# Altium schematic sheet Sheet7.SchDoc
size A3
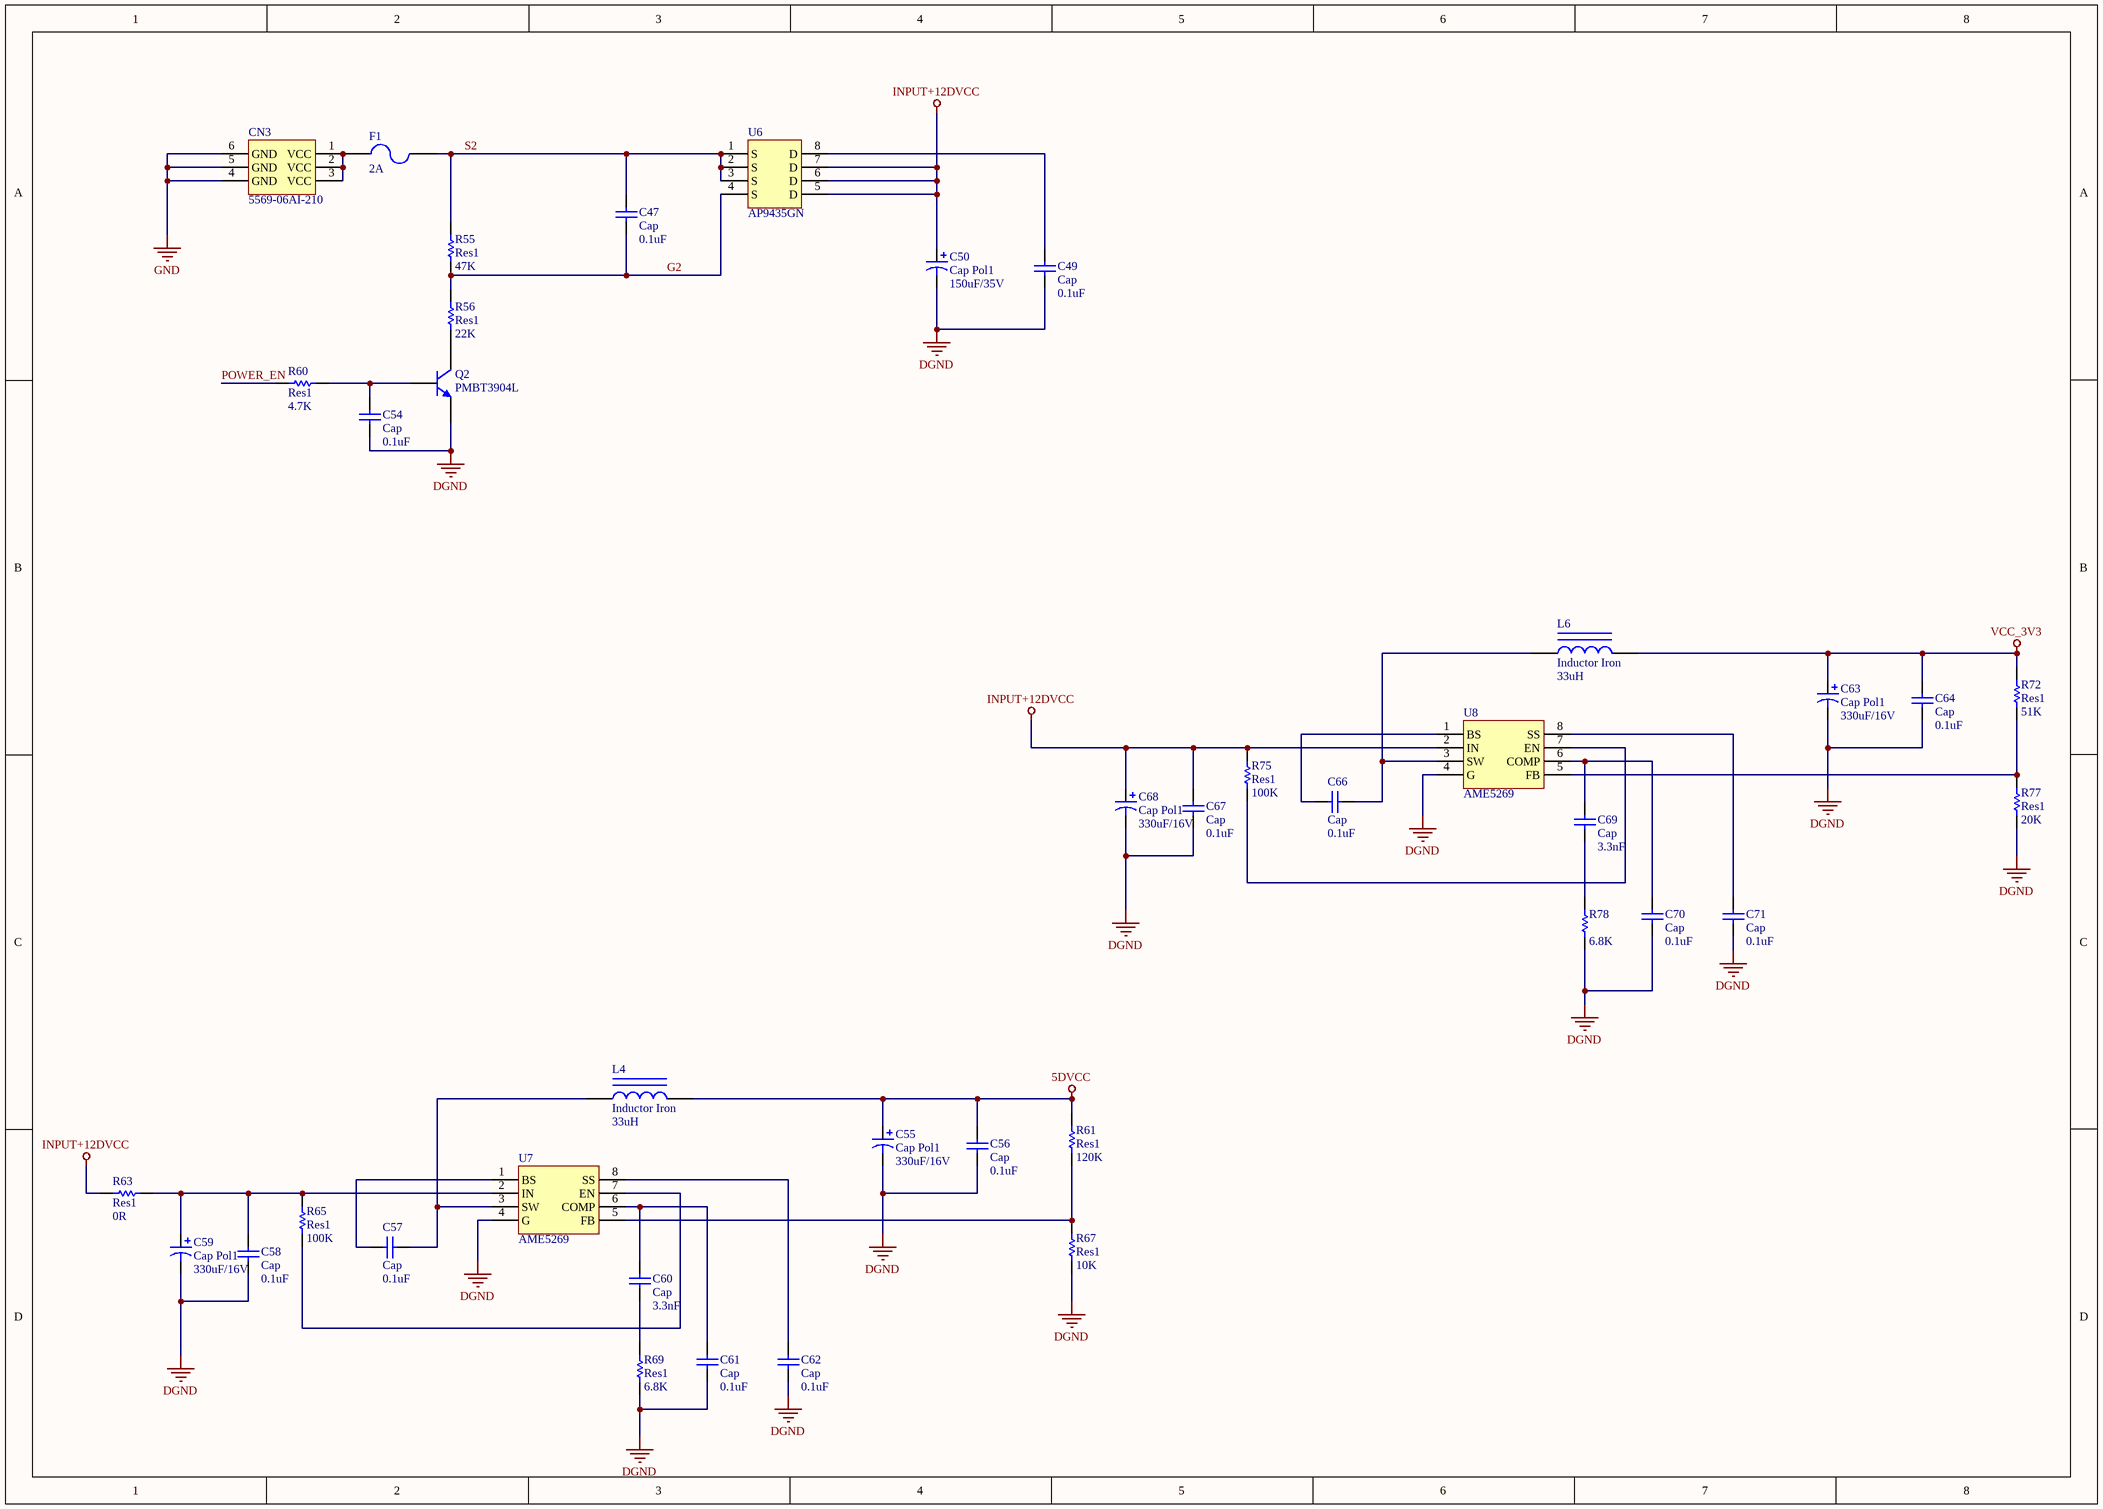
[diagram p0: Sheet7.SchDoc]

## Parts
C47  Cap  value 0.1uF  [C-0402]
C49  Cap  value 0.1uF  [C-0402]
C50  Cap Pol1  value 150uF/35V  [CE-D5.0]
C54  Cap  value 0.1uF  [C-0402]
C55  Cap Pol1  value 330uF/16V  [C-0402]
C56  Cap  value 0.1uF  [C-0402]
C57  Cap  value 0.1uF  [C-0402]
C58  Cap  value 0.1uF  [C-0402]
C59  Cap Pol1  value 330uF/16V  [CE-D3.6]
C60  Cap  value 3.3nF  [C-0402]
C61  Cap  value 0.1uF  [C-0402]
C62  Cap  value 0.1uF  [C-0402]
C63  Cap Pol1  value 330uF/16V  [CE-D3.6]
C64  Cap  value 0.1uF  [C-0402]
C66  Cap  value 0.1uF  [C-0402]
C67  Cap  value 0.1uF  [C-0402]
C68  Cap Pol1  value 330uF/16V  [CE-D3.6]
C69  Cap  value 3.3nF  [C-0402]
C70  Cap  value 0.1uF  [C-0402]
C71  Cap  value 0.1uF  [C-0402]
CN3  5569-06AI-210  [SOT23-6_L]
F1  2A  [R-1206]
L4  Inductor Iron  value 33uH  [INDC4532]
L6  Inductor Iron  value 33uH  [INDC4532]
Q2  PMBT3904L  [Q-SOT23]
R55  Res1  value 47K  [R-0603]
R56  Res1  value 22K  [R-0603]
R60  Res1  value 4.7K  [R-0603]
R61  Res1  value 120K  [R-0603]
R63  Res1  value 0R  [R-0603]
R65  Res1  value 100K  [R-0603]
R67  Res1  value 10K  [R-0603]
R69  Res1  value 6.8K  [R-0603]
R72  Res1  value 51K  [R-0603]
R75  Res1  value 100K  [R-0603]
R77  Res1  value 20K  [R-0603]
R78  value 6.8K  [R-0603]  (hidden comment: Res1)
U6  AP9435GN  [U-SOP/1.3]
U7  AME5269  [U-SOP/1.3]
U8  AME5269  [U-SOP/1.3]

## Nets
5DVCC: C55.1 C56.1 L4.2 R61.1
DGND: C49.1 C50.2 C54.1 C55.2 C56.2 C58.2 C59.2 C61.2 C62.2 C63.2 C64.2 C67.2 C68.2 C70.2 C71.2 Q2.1(E) R67.2 R69.2 R77.2 R78.2 U7.4(G) U8.4(G)
GND: CN3.4(GND) CN3.5(GND) CN3.6(GND)
INPUT+12DVCC: C50.1 C67.1 C68.1 R63.1 R75.1 U6.5(D) U6.6(D) U6.7(D) U8.2(IN)
VCC_3V3: C63.1 C64.1 L6.2 R72.1
G2: C47.1 R55.1 R56.2 U6.4(S)
POWER_EN: R60.2
S2: C47.2 F1.2 R55.2 U6.1(S) U6.2(S) U6.3(S)
NetC49_2: C49.2 U6.8(D)
NetC54_2: C54.2 Q2.2(B) R60.1
NetC57_1: C57.1 L4.1 U7.3(SW)
NetC57_2: C57.2 U7.1(BS)
NetC58_1: C58.1 C59.1 R63.2 R65.1 U7.2(IN)
NetC60_1: C60.1 C61.1 U7.6(COMP)
NetC60_2: C60.2 R69.1
NetC62_1: C62.1 U7.8(SS)
NetC66_1: C66.1 L6.1 U8.3(SW)
NetC66_2: C66.2 U8.1(BS)
NetC69_1: C69.1 C70.1 U8.6(COMP)
NetC69_2: C69.2 R78.1
NetC71_1: C71.1 U8.8(SS)
NetCN3_1: CN3.1(VCC) CN3.2(VCC) CN3.3(VCC) F1.1
NetQ2_3: Q2.3(C) R56.1
NetR61_2: R61.2 R67.1 U7.5(FB)
NetR65_2: R65.2 U7.7(EN)
NetR72_2: R72.2 R77.1 U8.5(FB)
NetR75_2: R75.2 U8.7(EN)

## Library data of the parts
C47 C49 C54 C56-C58 C60-C62 C64 C66 C67 C69-C71 = Cap: Capacitor; Published: 8-Jun-2000; LatestRevisionDate: 17-Jul-2002; LatestRevisionNote: Re-released for DXP Platform.; PackageReference: RAD-0.3; Publisher: Altium Limited; PackageDescription: Radial Cap, Thru-Hole; 2 Leads; 0.3 in Pin Spacing
C50 C55 C59 C63 C68 = Cap Pol1: Polarized Capacitor (Radial); Published: 8-Jun-2000; LatestRevisionDate: 17-Jul-2002; LatestRevisionNote: Re-released for DXP Platform.; PackageReference: RB7.6-15; Publisher: Altium Limited; PackageDescription: Polarized Capacitor (Radial); 2 Leads
F1 = Fuse 2: Fuse; Published: 8-Jun-2000; LatestRevisionDate: 17-Jul-2002; LatestRevisionNote: Re-released for DXP Platform.; PackageReference: PIN-W2/E2.8; Publisher: Altium Limited; PackageDescription: Thru-Hole; 2 Leads
L4 L6 = Inductor Iron: Magnetic-Core Inductor; Published: 24-Mar-1999; LatestRevisionDate: 17-Jul-2002; LatestRevisionNote: Re-released for DXP Platform.; PackageReference: AXIAL-0.9; Publisher: Altium Limited; PackageDescription: Axial Device, Thru-Hole; 2 Leads; 0.9 in Pin Spacing
Q2 = 2N3904: NPN General Purpose Amplifier; Published: 8-Jun-2000; LatestRevisionDate: 15-Jan-2003; LatestRevisionNote: PCB Footprint 'BCY-W3/D4.7' replaced; DatasheetVersion: 1997; PackageVersion: Sep-1998; PackageReference: TO-92A; Publisher: Altium Limited; PackageDescription: TO, Flat Index; 3 In-Line, Axial Leads; Body Dia. 4.5mm; Leads 0.51 x 0.48 mm (max); ComponentLink1Description: Manufacturer Link; ComponentLink1URL: http://www.fairchildsemi.com/; ComponentLink2Description: Datasheet; ComponentLink2URL: http://www.fairchildsemi.com/ds/2N%2F2N3904.pdf
R55 R56 R60 R61 R63 R65 R67 R69 R72 R75 R77 R78 = Res1: Resistor; Published: 8-Jun-2000; LatestRevisionDate: 17-Jul-2002; LatestRevisionNote: Re-released for DXP Platform.; PackageReference: AXIAL-0.3; Publisher: Altium Limited; PackageDescription: Axial Device, Thru-Hole; 2 Leads; 0.3 in Pin Spacing